# EasyEDA Pro project ProPrj_HPMDuino_DEV_2025-07-16.epro, board PCB1
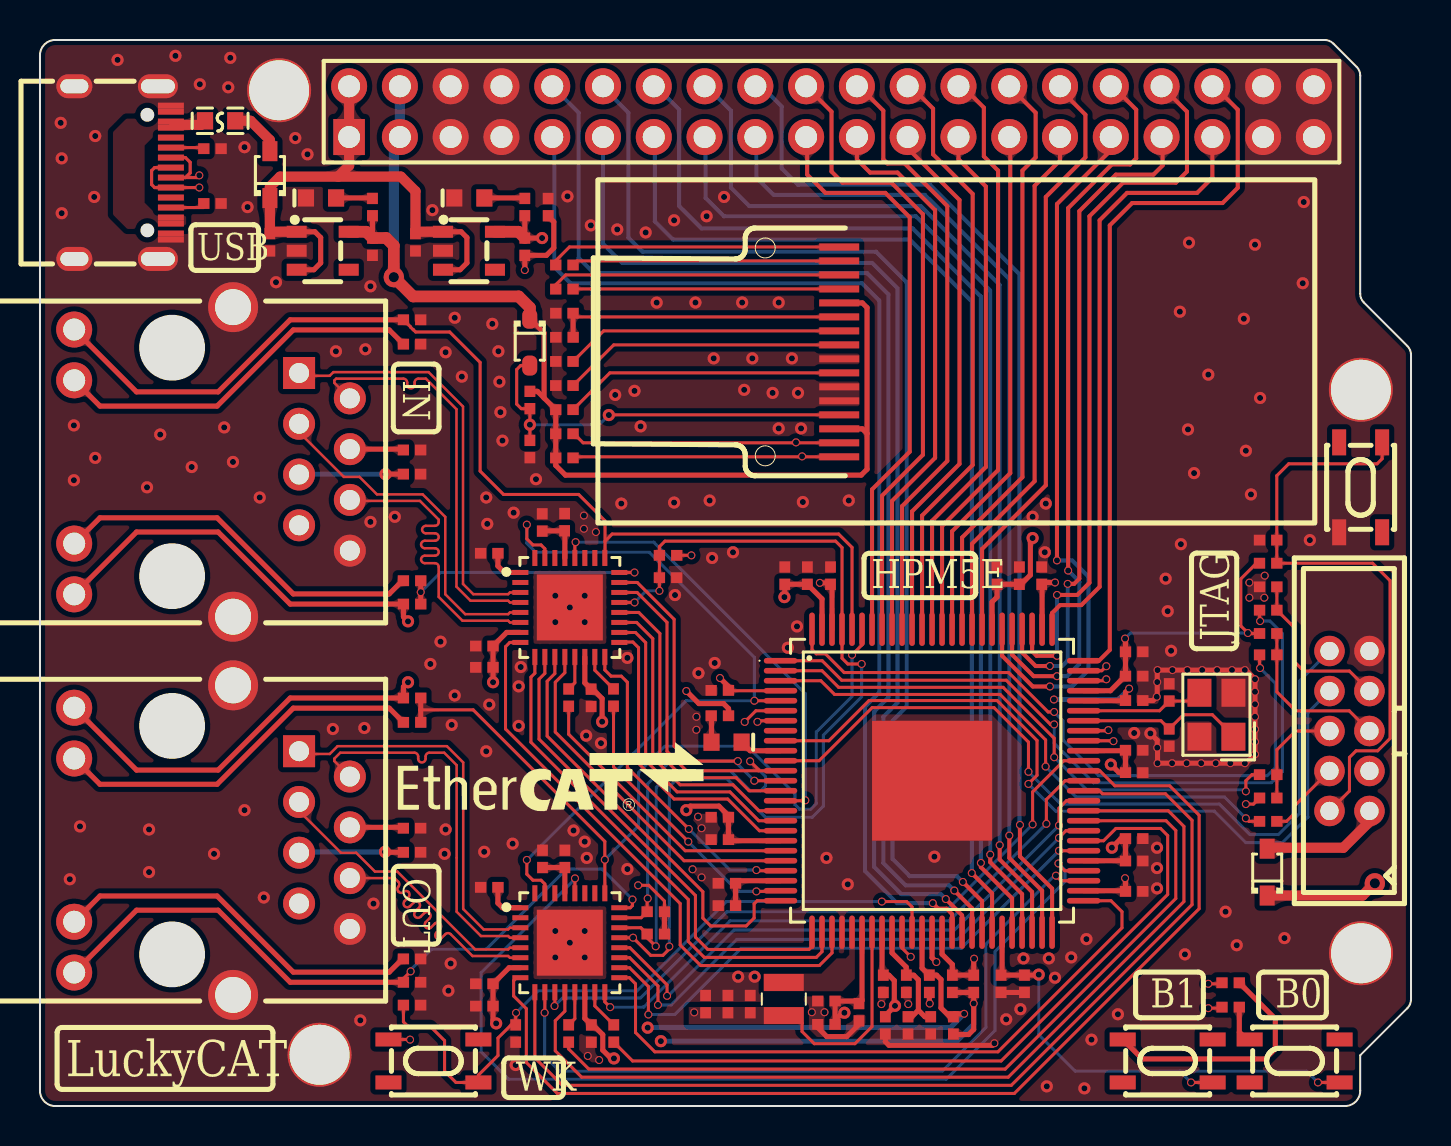
[diagram p6: board, top side]
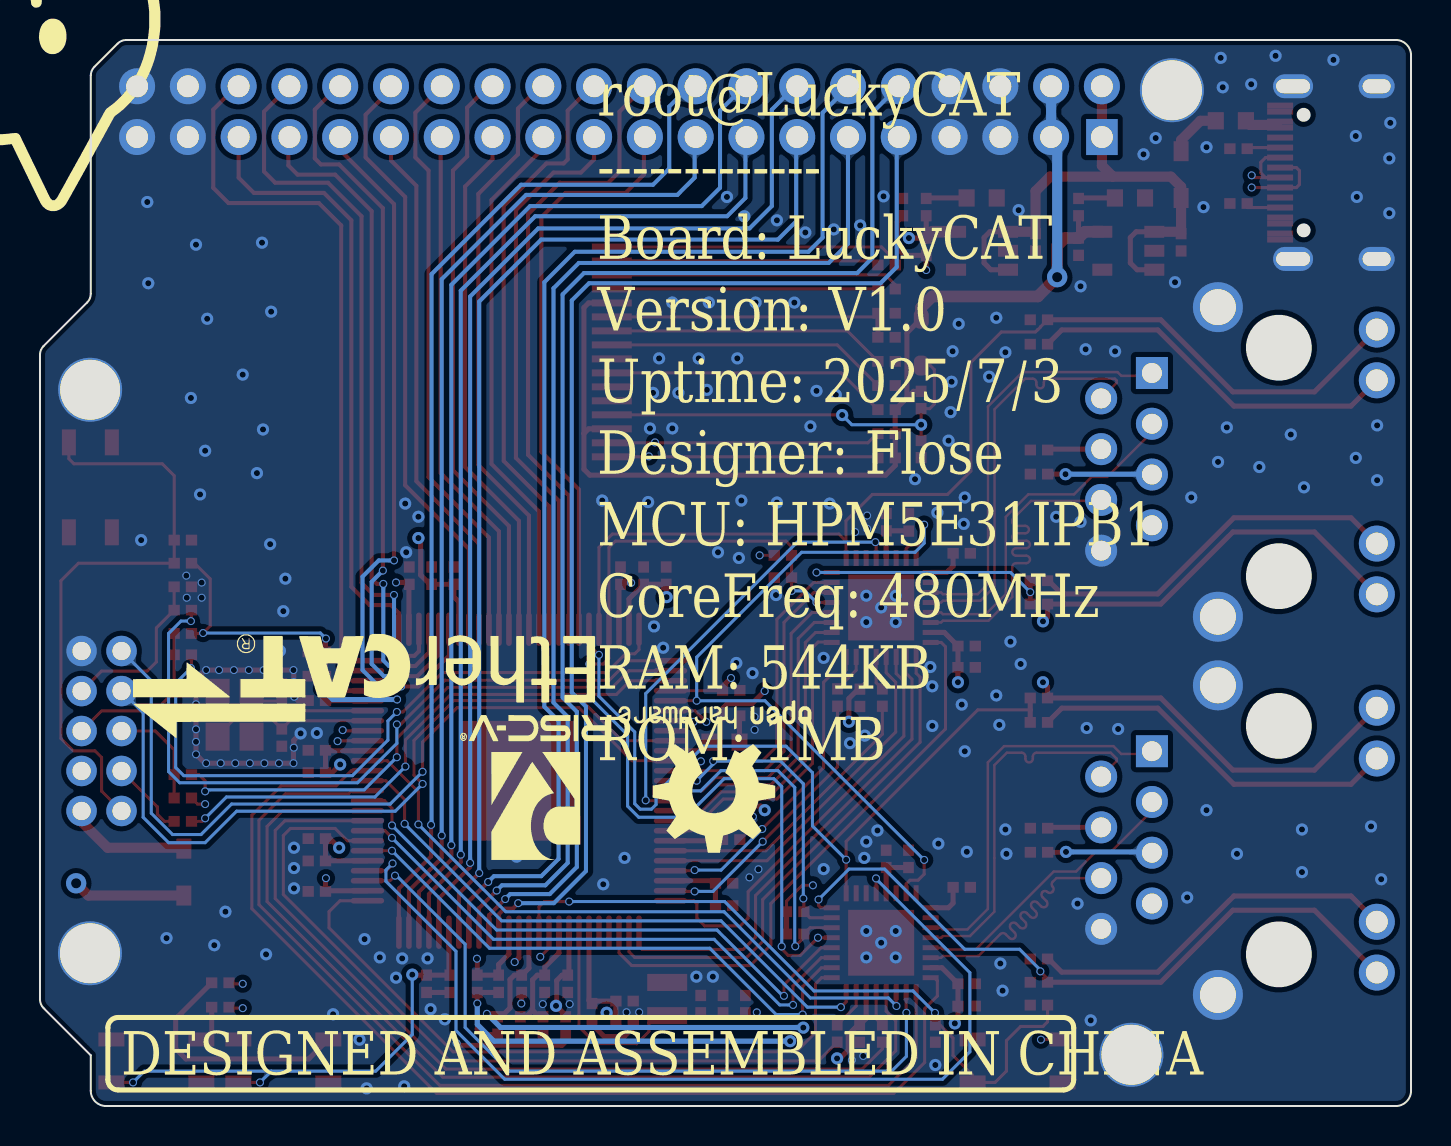
[diagram p7: board, bottom side, seen from below]

Outline 68.58 x 53.34 mm; copper layers: Top Layer, GND, PWR, Bottom Layer. Coordinates in mm from the lower left corner of the outline.
Outline path: 0,52.58 0,0.76 arc(0.22,0.22) 0.76,0 65.28,0 arc(65.82,0.22) 66.04,0.76 66.04,2.54 68.4,4.9 arc(68.53,5.1) 68.58,5.33 68.58,37.59 arc(68.53,37.83) 68.4,38.03 66.22,40.21 arc(66.09,40.41) 66.04,40.64 66.04,51.56 arc(65.99,51.8) 65.86,52 64.7,53.16 arc(64.5,53.29) 64.26,53.34 0.76,53.34 arc(0.22,53.12) 0,52.58
Stack: Top Layer 0.035mm 外层铜厚1oz / Dielectric1 0.2104mm 7628 RC49% 8.6mil / GND 0.0152mm 内层铜厚 / Dielectric2 1.065mm 1.1mm H/HOZ Copper / PWR 0.0152mm 内层铜厚 / Dielectric3 0.2104mm 7628 RC49% 8.6mil / Bottom Layer 0.035mm 外层铜厚1oz

## Design rules (mm)
net ESC0_P0_TD_P: ESC0_P0_TD
net ESC0_P0_TD_N: ESC0_P0_TD
net ESC0_P0_RD_P: ESC0_P0_RD
net ESC0_P0_RD_N: ESC0_P0_RD
net ESC0_P1_TD_P: ESC0_P1_TD
net ESC0_P1_TD_N: ESC0_P1_TD
net ESC0_P1_RD_P: ESC0_P1_RD
net ESC0_P1_RD_N: ESC0_P1_RD
net USB_DM: USB
net USB_DP: USB
template: 自定义配置
spacing copperThickness1oz (default): track to track 0.102, other pairs 0.152 to 0.3
spacing copperThickness2oz: track to track 0.203, other pairs 0.152 to 0.3
spacing copperThicknessInner0.5oz: track to track 0.089, other pairs 0.152 to 0.3
track width copperThickness1oz (default): min 0.102, default 0.254, max 2.54
track width copperThickness2oz: min 0.203, default 0.254, max 2.54
track width copperThickness0.5oz: min 0.089, default 0.254, max 2.54
differential pair differentialPair (default): width min 0.127, default 0.254, max 2.54; gap min 0.152, default 0.152
differential pair ETH/100ohm: width min 0.124, default 0.124, max 0.124; gap min 0.203, default 0.203
differential pair USB/90ohm: width min 0.137, default 0.137, max 0.178; gap min 0.203, default 0.203
via viaSize (default): diameter min 0.3, default 0.61, max 10; hole min 0.201, default 0.305, max 6.299
net GND uses copperRegion1
net VBUS uses copperRegion1
net ESC0_P0_TD_P uses ETH/100ohm
net ESC0_P0_TD_N uses ETH/100ohm
net ESC0_P0_RD_P uses ETH/100ohm
net ESC0_P0_RD_N uses ETH/100ohm
net ESC0_P1_TD_P uses ETH/100ohm
net ESC0_P1_TD_N uses ETH/100ohm
net ESC0_P1_RD_P uses ETH/100ohm
net ESC0_P1_RD_N uses ETH/100ohm
net USB_DM uses USB/90ohm
net USB_DP uses USB/90ohm
diff pair ESC0_P0_TD uses ETH/100ohm
diff pair ESC0_P0_RD uses ETH/100ohm
diff pair ESC0_P1_TD uses ETH/100ohm
diff pair ESC0_P1_RD uses ETH/100ohm
diff pair USB uses USB/90ohm

## Placement (name value [footprint] x y rotation side)
C1  15pF  [c0402-无丝印-全尺寸_2]  56.48 18.43 90 top
C2  1uF  [c0402-无丝印-全尺寸_2]  11.5 43.22 90 top
C3  1uF  [c0402-无丝印-全尺寸_2]  16.63 43 90 top
C4  15pF  [c0402-无丝印-全尺寸_2]  56.48 20.7 270 top
C5  1uF  [c0402-无丝印-全尺寸_2]  18.78 43.22 90 top
C6  1uF  [c0402-无丝印-全尺寸_2]  24.25 43 90 top
C7  22uF  [c0402-无丝印-全尺寸_2]  33.29 5.1 270 top
C8  22uF  [c0402-无丝印-全尺寸_2]  34.41 5.1 270 top
C9  100nF  [c0402-无丝印-全尺寸_2]  35.53 5.1 270 top
C10  100nF  [c0402-无丝印-全尺寸_2]  34.01 20.8 0 top
C11  100nF  [c0402-无丝印-全尺寸_2]  54.73 10.74 180 top
C12  100nF  [c0402-无丝印-全尺寸_2]  54.73 20.29 180 top
C13  100nF  [c0402-无丝印-全尺寸_2]  50.11 26.54 270 top
C14  100nF  [c0402-无丝印-全尺寸_2]  39.54 26.54 270 top
C15  100nF  [c0402-无丝印-全尺寸_2]  61.43 28.32 0 top
C16  100nF  [c0402-无丝印-全尺寸_2]  23.79 3.63 90 top
C17  22uF  [c0402-无丝印-全尺寸_2]  39.34 5.25 0 top
C18  22uF  [c0402-无丝印-全尺寸_2]  39.34 4.08 0 top
C19  100nF  [c0402-无丝印-全尺寸_2]  40.96 4.69 90 top
C20  10uF  [c0402-无丝印-全尺寸_2]  42.29 4.03 90 top
C21  100nF  [c0402-无丝印-全尺寸_2]  42.18 6.12 90 top
C22  10uF  [c0402-无丝印-全尺寸_2]  34.36 10.03 0 top
C23  100nF  [c0402-无丝印-全尺寸_2]  34.36 11.15 0 top
C24  10uF  [c0402-无丝印-全尺寸_2]  44.55 4.03 90 top
C25  10uF  [c0402-无丝印-全尺寸_2]  43.42 4.03 90 top
C26  100nF  [c0402-无丝印-全尺寸_2]  43.34 6.12 90 top
C27  10uF  [c0402-无丝印-全尺寸_2]  45.69 4.03 90 top
C28  100nF  [c0402-无丝印-全尺寸_2]  44.49 6.12 90 top
C29  10uF  [c0402-无丝印-全尺寸_2]  46.7 6.12 90 top
C30  100nF  [c0402-无丝印-全尺寸_2]  45.64 6.12 90 top
C31  10uF  [c0402-无丝印-全尺寸_2]  34.01 14.45 0 top
C32  100nF  [c0402-无丝印-全尺寸_2]  34.01 13.33 0 top
C33  10uF  [c0402-无丝印-全尺寸_2]  54.73 22.73 180 top
C34  100nF  [c0402-无丝印-全尺寸_2]  54.73 21.51 180 top
C35  10uF  [c0402-无丝印-全尺寸_2]  48.99 26.54 270 top
C36  100nF  [c0402-无丝印-全尺寸_2]  47.87 26.54 270 top
C37  10uF  [c0402-无丝印-全尺寸_2]  37.26 26.54 270 top
C38  100nF  [c0402-无丝印-全尺寸_2]  38.39 26.54 270 top
C39  10uF  [c0402-无丝印-全尺寸_2]  54.73 13.38 180 top
C40  100nF  [c0402-无丝印-全尺寸_2]  54.73 12.26 180 top
C41  10uF  [c0402-无丝印-全尺寸_2]  54.73 16.68 180 top
C42  100nF  [c0402-无丝印-全尺寸_2]  54.73 17.8 180 top
C43  10uF  [c0402-无丝印-全尺寸_2]  49.24 6.12 90 top
C44  100nF  [c0402-无丝印-全尺寸_2]  48.08 6.12 90 top
C45  10uF  [c0402-无丝印-全尺寸_2]  22.23 21.95 0 top
C46  100nF  [c0402-无丝印-全尺寸_2]  22.23 23.02 0 top
C47  100nF  [c0402-无丝印-全尺寸_2]  27.57 20.42 90 top
C48  10uF  [c0402-无丝印-全尺寸_2]  25.12 29.2 270 top
C49  100nF  [c0402-无丝印-全尺寸_2]  26.24 29.21 270 top
C50  100nF  [c0402-无丝印-全尺寸_2]  18.61 31.62 0 top
C51  100nF  [c0402-无丝印-全尺寸_2]  18.61 32.82 0 top
C52  100nF  [c0402-无丝印-全尺寸_2]  31.42 26.44 180 top
C53  10uF  [c0402-无丝印-全尺寸_2]  22.23 5 0 top
C54  100nF  [c0402-无丝印-全尺寸_2]  27.58 3.62 90 top
C55  100nF  [c0402-无丝印-全尺寸_2]  22.23 6.12 0 top
C56  1uF  [c0402-无丝印-全尺寸_2]  26.23 42.08 0 top
C57  1uF  [c0402-无丝印-全尺寸_2]  26.23 40.88 0 top
C58  4.7uF  [c0402-无丝印-全尺寸_2]  26.24 38.46 180 top
C59  100nF  [c0402-无丝印-全尺寸_2]  26.23 39.67 0 top
C60  10uF  [c0402-无丝印-全尺寸_2]  25.14 12.37 270 top
C61  100nF  [c0402-无丝印-全尺寸_2]  26.25 12.37 270 top
C62  100nF  [c0402-无丝印-全尺寸_2]  18.61 12.69 0 top
C63  2.2uF  [c0402-无丝印-全尺寸_2]  26.23 37.26 0 top
C64  100nF  [c0402-无丝印-全尺寸_2]  18.61 13.9 0 top
C65  4.7uF  [c0402-无丝印-全尺寸_2]  24.51 32.87 90 top
D1  B16WS  [SOD-323_L1.8-W1.3-LS2.5-RD]  11.5 46.6 90 top
D2  B16WS  [SOD-323_L1.8-W1.3-LS2.5-RD]  61.39 11.7 90 top
D3  1N4148WS  [SOD-323_L1.8-W1.3-LS2.5-RD#2]  24.5 38.22 270 top
F1  BSMD0603-075-6V  [F0603]  9.01 49.3 0 top
H1  -  [HDR-TH_40P-P2.54-V-M-R2-C20-S2.54]  39.59 49.75 0 top
J1  HR911105A  [RJ45-TH_HR911105A]  8.61 32.23 270 top
J2  HR911105A  [RJ45-TH_HR911105A]  8.61 13.3 270 top
L1  4.7uH  [IND-SMD_L2.5-W2.0-VLS252012CX-150M]  37.21 5.35 270 top
L2  NCD0603G1  [LED0603_S]  34.97 18.21 0 top
L3  NCD0603G1  [LED0603_S]  13.43 45.44 180 top
L4  NCD0603G1  [LED0603_S]  20.85 45.44 180 top
OLED1  -  [1.29'OLED-64x128-16P]  45.59 37.71 180 top
P1  2.0-2*5P直简牛  [IDC-TH_10P-P2.00-V-R2-C5-S2.00]  65.5 18.77 90 top
R1  10K  [r0402-无丝印-全尺寸_1]  61.43 27.16 0 top
R2  10K  [r0402-无丝印-全尺寸_1]  34.01 19.53 180 top
R3  0Ω  [r0402-无丝印-全尺寸_1]  25.42 44.98 90 top
R4  10K  [r0402-无丝印-全尺寸_1]  18.61 5.05 180 top
R5  10K  [r0402-无丝印-全尺寸_1]  59.56 4.95 0 top
R6  10K  [r0402-无丝印-全尺寸_1]  16.63 44.98 90 top
R7  10K  [r0402-无丝印-全尺寸_1]  24.25 44.98 90 top
R8  10K  [r0402-无丝印-全尺寸_1]  59.56 6.17 0 top
R9  33Ω  [r0402-无丝印-全尺寸_1]  28.69 20.44 270 top
R10  33Ω  [r0402-无丝印-全尺寸_1]  26.45 20.44 270 top
R11  5.1K  [r0402-无丝印-全尺寸_1]  8.63 47.9 0 top
R12  5.1K  [r0402-无丝印-全尺寸_1]  8.63 45.16 0 top
R13  100Ω  [r0402-无丝印-全尺寸_1]  61.44 24.81 180 top
R14  100Ω  [r0402-无丝印-全尺寸_1]  61.44 22.58 180 top
R15  10K  [r0402-无丝印-全尺寸_1]  61.44 25.98 180 top
R16  100Ω  [r0402-无丝印-全尺寸_1]  61.44 16.58 180 top
R17  10K  [r0402-无丝印-全尺寸_1]  61.44 23.64 180 top
R18  100Ω  [r0402-无丝印-全尺寸_1]  61.44 14.24 180 top
R19  10K  [r0402-无丝印-全尺寸_1]  61.44 15.41 180 top
R20  4.7K  [r0402-无丝印-全尺寸_1]  18.61 39.34 180 top
R21  2.49K  [r0402-无丝印-全尺寸_1]  22.47 27.66 180 top
R22  330Ω  [r0402-无丝印-全尺寸_1]  18.61 38.12 180 top
R23  10K  [r0402-无丝印-全尺寸_1]  31.42 27.55 180 top
R24  4.7K  [r0402-无丝印-全尺寸_1]  18.61 25.12 180 top
R25  330Ω  [r0402-无丝印-全尺寸_1]  18.61 26.28 180 top
R26  33Ω  [r0402-无丝印-全尺寸_1]  28.7 3.63 270 top
R27  390K  [r0402-无丝印-全尺寸_1]  26.23 36.05 0 top
R28  33Ω  [r0402-无丝印-全尺寸_1]  26.45 3.63 270 top
R29  4.7K  [r0402-无丝印-全尺寸_1]  24.51 35.33 90 top
R30  4.7K  [r0402-无丝印-全尺寸_1]  26.23 34.84 0 top
R31  4.7K  [r0402-无丝印-全尺寸_1]  26.23 33.64 0 top
R32  4.7K  [r0402-无丝印-全尺寸_1]  30.8 8.61 0 top
R33  4.7K  [r0402-无丝印-全尺寸_1]  30.8 9.72 0 top
R34  4.7K  [r0402-无丝印-全尺寸_1]  26.23 32.43 0 top
R35  4.7K  [r0402-无丝印-全尺寸_1]  18.61 20.42 180 top
R36  2.49K  [r0402-无丝印-全尺寸_1]  22.47 10.94 180 top
R37  330Ω  [r0402-无丝印-全尺寸_1]  18.61 19.2 180 top
R38  4.7K  [r0402-无丝印-全尺寸_1]  18.61 6.19 180 top
R39  330Ω  [r0402-无丝印-全尺寸_1]  18.61 7.36 180 top
SW1  PTS815SJK250SMTRLFS  [SW-SMD_4P-L4.2-W3.3-P2.15-LS5.1]  19.68 2.26 0 top
SW2  PTS815SJK250SMTRLFS  [SW-SMD_4P-L4.2-W3.3-P2.15-LS5.1]  66.06 30.96 90 top
SW3  PTS815SJK250SMTRLFS  [SW-SMD_4P-L4.2-W3.3-P2.15-LS5.1]  62.76 2.26 0 top
SW4  PTS815SJK250SMTRLFS  [SW-SMD_4P-L4.2-W3.3-P2.15-LS5.1]  56.41 2.26 0 top
U1  XC6210B332MR  [SOT-23-5_L3.0-W1.7-P0.95-LS2.8-BR]  14.14 42.79 180 top
U2  LP5907QMFX-3.3Q1  [SOT-23-5_L3.0-W1.7-P0.95-LS2.8-BR]  21.46 42.79 180 top
U3  JL1111-N032I  [QFN-32_L5.0-W5.0-P0.50-TL-EP3.3]  26.5 24.95 0 top
U4  JL1111-N032I  [QFN-32_L5.0-W5.0-P0.50-TL-EP3.3]  26.5 8.17 0 top
U5  -  [M3无外边]  66.08 7.64 0 top
U5#2  -  [eLQFP-100]  44.62 16.28 0 top
U6  -  [M3无外边]  66.07 35.84 0 top
U7  -  [M3无外边]  11.96 50.82 0 top
U8  -  [M3无外边]  13.98 2.56 0 top
USB1  KH-TYPE-C-16P  [USB-C-SMD_KH-TYPE-C-16P]  4.13 46.71 270 top
X1  24MHz  [CRYSTAL-SMD_4P-L3.2-W2.5-BL]  58.85 19.58 90 top

## Footprints (pads in the part's own frame, mm; a bottom-side part is the same pattern mirrored in y, then rotated)
1.29'OLED-64x128-16P
  rect 2x0.35 smd: 1(5.61,-5.27) 2(5.61,-4.57) 3(5.61,-3.87) 4(5.61,-3.17) 5(5.61,-2.47) 6(5.61,-1.77) 7(5.61,-1.07) 8(5.61,-0.37) 9(5.61,0.33) 10(5.61,1.03) 11(5.61,1.73) 12(5.61,2.43) 13(5.61,3.13) 14(5.61,3.83) 15(5.61,4.53) 16(5.61,5.23)
c0402-无丝印-全尺寸_2
  rect 0.566x0.54 smd: 1(-0.433,0) 2(0.433,0)
CRYSTAL-SMD_4P-L3.2-W2.5-BL
  rect 1.4x1.2 smd: 1(-1.1,-0.85) 2(1.1,-0.85) 3(1.1,0.85) 4(-1.1,0.85)
eLQFP-100
  oval 1.67x0.28 smd: 1(-7.58,6.005) 2(-7.58,5.504) 3(-7.58,5.004) 4(-7.58,4.503) 5(-7.58,4.003) 6(-7.58,3.502) 7(-7.58,3.002) 8(-7.58,2.502) 9(-7.58,2.002) 10(-7.58,1.501) 11(-7.58,1.001) 12(-7.58,0.5) 13(-7.58,0) 14(-7.58,-0.5) 15(-7.58,-1.001) 16(-7.58,-1.501) 17(-7.58,-2.002) 18(-7.58,-2.502) 19(-7.58,-3.002) 20(-7.58,-3.502) 21(-7.58,-4.003) 22(-7.58,-4.503) 23(-7.58,-5.004) 24(-7.58,-5.504) 25(-7.58,-6.005) 51(7.58,-6.005) 52(7.58,-5.504) 53(7.58,-5.004) 54(7.58,-4.503) 55(7.58,-4.003) 56(7.58,-3.502) 57(7.58,-3.002) 58(7.58,-2.502) 59(7.58,-2.002) 60(7.58,-1.501) 61(7.58,-1.001) 62(7.58,-0.5) 63(7.58,0) 64(7.58,0.5) 65(7.58,1.001) 66(7.58,1.501) 67(7.58,2.002) 68(7.58,2.502) 69(7.58,3.002) 70(7.58,3.502) 71(7.58,4.003) 72(7.58,4.503) 73(7.58,5.004) 74(7.58,5.504) 75(7.58,6.005)
  oval 0.28x1.67 smd: 26(-6.005,-7.58) 27(-5.504,-7.58) 28(-5.004,-7.58) 29(-4.503,-7.58) 30(-4.003,-7.58) 31(-3.502,-7.58) 32(-3.002,-7.58) 33(-2.502,-7.58) 34(-2.002,-7.58) 35(-1.501,-7.58) 36(-1.001,-7.58) 37(-0.5,-7.58) 38(0,-7.58) 39(0.5,-7.58) 40(1.001,-7.58) 41(1.501,-7.58) 42(2.002,-7.58) 43(2.502,-7.58) 44(3.002,-7.58) 45(3.502,-7.58) 46(4.003,-7.58) 47(4.503,-7.58) 48(5.004,-7.58) 49(5.504,-7.58) 50(6.005,-7.58) 76(6.005,7.58) 77(5.504,7.58) 78(5.004,7.58) 79(4.503,7.58) 80(4.003,7.58) 81(3.502,7.58) 82(3.002,7.58) 83(2.502,7.58) 84(2.002,7.58) 85(1.501,7.58) 86(1.001,7.58) 87(0.5,7.58) 88(0,7.58) 89(-0.5,7.58) 90(-1.001,7.58) 91(-1.501,7.58) 92(-2.002,7.58) 93(-2.502,7.58) 94(-3.002,7.58) 95(-3.502,7.58) 96(-4.003,7.58) 97(-4.503,7.58) 98(-5.004,7.58) 99(-5.504,7.58) 100(-6.005,7.58)
  rect 6x6 smd: 101(0,0)
F0603
  rect 0.806x0.864 smd: 1(-0.753,0) 2(0.753,0)
HDR-TH_40P-P2.54-V-M-R2-C20-S2.54
  rect 1.575x1.801 hole 1.1: 1(-24.13,-1.27)
  round 1.801 hole 1.1: 2(-24.13,1.27) 3(-21.59,-1.27) 4(-21.59,1.27) 5(-19.05,-1.27) 6(-19.05,1.27) 7(-16.51,-1.27) 8(-16.51,1.27) 9(-13.97,-1.27) 10(-13.97,1.27) 11(-11.43,-1.27) 12(-11.43,1.27) 13(-8.89,-1.27) 14(-8.89,1.27) 15(-6.35,-1.27) 16(-6.35,1.27) 17(-3.81,-1.27) 18(-3.81,1.27) 19(-1.27,-1.27) 20(-1.27,1.27) 21(1.27,-1.27) 22(1.27,1.27) 23(3.81,-1.27) 24(3.81,1.27) 25(6.35,-1.27) 26(6.35,1.27) 27(8.89,-1.27) 28(8.89,1.27) 29(11.43,-1.27) 30(11.43,1.27) 31(13.97,-1.27) 32(13.97,1.27) 33(16.51,-1.27) 34(16.51,1.27) 35(19.05,-1.27) 36(19.05,1.27) 37(21.59,-1.27) 38(21.59,1.27) 39(24.13,-1.27) 40(24.13,1.27)
IDC-TH_10P-P2.00-V-R2-C5-S2.00
  round 1.524 hole 0.914: 1(-4.002,-1) 2(-4.002,1) 3(-2.001,-1) 4(-2.001,1) 5(-0.002,-1) 6(-0.002,1) 7(1.998,-1) 8(1.998,1) 9(4.002,-1) 10(4.002,1)
IND-SMD_L2.5-W2.0-VLS252012CX-150M
  rect 0.85x2 smd: 1(-0.83,0) 2(0.83,0)
LED0603_S
  rect 0.806x0.864 smd: 1(-1.381,-0.001) 2(0.126,-0.001)
M3无外边
  round 3.2 hole 3: 1(0,0)
QFN-32_L5.0-W5.0-P0.50-TL-EP3.3
  rect 0.8x0.25 smd: 1(-2.475,1.75) 2(-2.475,1.25) 3(-2.475,0.75) 4(-2.475,0.25) 5(-2.475,-0.25) 6(-2.475,-0.75) 7(-2.475,-1.25) 8(-2.475,-1.75) 17(2.475,-1.75) 18(2.475,-1.25) 19(2.475,-0.75) 20(2.475,-0.25) 21(2.475,0.25) 22(2.475,0.75) 23(2.475,1.25) 24(2.475,1.75)
  rect 0.25x0.8 smd: 9(-1.75,-2.475) 10(-1.25,-2.475) 11(-0.75,-2.475) 12(-0.25,-2.475) 13(0.25,-2.475) 14(0.75,-2.475) 15(1.25,-2.475) 16(1.75,-2.475) 25(1.75,2.475) 26(1.25,2.475) 27(0.75,2.475) 28(0.25,2.475) 29(-0.25,2.475) 30(-0.75,2.475) 31(-1.25,2.475) 32(-1.75,2.475)
  rect 3.3x3.3 smd: 33(0,0)
r0402-无丝印-全尺寸_1
  rect 0.566x0.54 smd: 1(-0.433,0) 2(0.433,0)
RJ45-TH_HR911105A
  rect 1.6x1.6 hole 1: 1(-4.45,4.355)
  round 1.6 hole 1: 2(-3.18,6.895) 3(-1.91,4.355) 4(-0.64,6.895) 5(0.63,4.355) 6(1.9,6.895) 7(3.17,4.355) 8(4.44,6.895)
  round 1.8 hole 1.1: 9(-6.625,-6.895) 10(-4.085,-6.895) 11(4.085,-6.895) 12(6.625,-6.895)
  round 2.5 hole 1.8: SH1(-7.745,1.055) SH2(7.745,1.055)
SOD-323_L1.8-W1.3-LS2.5-RD
  rect 1x0.75 smd: 1(-1.173,0) 2(1.173,0)
SOD-323_L1.8-W1.3-LS2.5-RD#2
  rrect 1x0.75 smd: 1(-1.173,0) 2(1.173,0)
SOT-23-5_L3.0-W1.7-P0.95-LS2.8-BR
  rect 1x0.6 smd: 1(1.3,-0.95) 2(1.3,0) 3(1.3,0.95) 4(-1.3,0.95) 5(-1.3,-0.95)
SW-SMD_4P-L4.2-W3.3-P2.15-LS5.1
  rect 1.3x0.7 smd: 1(-2.25,1.075) 2(2.25,1.075) 3(-2.25,-1.075) 4(2.25,-1.075)
USB-C-SMD_KH-TYPE-C-16P
  oval 1.2x2 hole 0.7x1.7: 1(-4.32,1.765) 2(4.32,1.765)
  oval 1.2x1.8 hole 0.7x1.4: 3(-4.32,-2.415) 4(4.32,-2.415)
  rect 0.3x1.3 smd: A1(-3.35,2.415) A4(-2.55,2.415) A5(-1.25,2.415) A6(-0.25,2.415) A7(0.25,2.415) A8(1.25,2.415) A9(2.55,2.415) A12(3.35,2.415) B1(3.05,2.415) B4(2.25,2.415) B5(1.75,2.415) B6(0.75,2.415) B7(-0.75,2.415) B8(-1.75,2.415) B9(-2.25,2.415) B12(-3.05,2.415)

## Nets
+5V: C2.2 C5.2 D1.1 D2.1 H1.1 H1.2 U1.1 U1.3 U2.1 U2.3
AGND: C6.1 C27.1 C28.1 C29.1 C30.1 R3.1 U5#2.38
AVCC: C6.2 C27.2 C28.2 C29.2 C30.2 R7.1 U2.5 U5#2.37 U5#2.39
GND: C1.1 C2.1 C3.1 C4.1 C5.1 C7.1 C8.1 C9.1 C10.1 C11.1 C12.1 C13.1 C14.1 C15.1 C16.1 C17.1 C18.1 C19.1 C20.1 C21.1 C22.1 C23.1 C24.1 C25.1 C26.1 C31.1 C32.1 C33.1 C34.1 C35.1 C36.1 C37.1 C38.1 C39.1 C40.1 C41.1 C42.1 C43.1 C44.1 C45.1 C46.1 C47.1 C48.1 C49.1 C50.2 C51.2 C52.1 C53.1 C54.1 C55.1 C58.2 C59.1 C60.1 C61.1 C62.2 C63.1 C64.2 C65.1 H1.5 H1.6 H1.7 H1.8 H1.37 H1.38 H1.39 H1.40 J1.8 J1.SH1 J1.SH2 J2.8 J2.SH1 J2.SH2 L3.2 L4.2 OLED1.9 OLED1.11 OLED1.12 P1.9 R3.2 R4.1 R11.2 R12.2 R15.2 R20.1 R21.2 R22.1 R27.1 R36.2 R38.1 R39.1 SW2.1 U1.2 U2.2 U3.33 U4.33 U5.1 U5#2.29 U5#2.101 U6.1 U7.1 U8.1 USB1.1 USB1.2 USB1.3 USB1.4 USB1.A1 USB1.A12 USB1.B1 USB1.B12 X1.2 X1.4
VBUS: F1.1 USB1.A4 USB1.A9 USB1.B4 USB1.B9
VDD_OTPCAP: C22.2 C23.2 U5#2.23
VDD_PMCCAP: C24.2 C25.2 C26.2 U5#2.34
_JTAG_TCK: P1.7 R13.1 R15.1
_JTAG_TDI: P1.6 R16.1 R19.1
_JTAG_TDO: P1.4 R18.1
_JTAG_TMS: P1.5 R14.1 R17.1
BOOT0: R5.1 U5#2.7
BOOT1: R8.1 U5#2.6
DCDC_IN: C3.2 C17.2 C18.2 C19.2 C20.2 C21.2 C31.2 C32.2 C33.2 C34.2 C35.2 C36.2 C37.2 C38.2 C39.2 C40.2 C41.2 C42.2 C43.2 C44.2 C45.2 C46.2 C47.2 C53.2 C54.2 C55.2 D3.1 H1.3 H1.4 J1.12 J2.9 OLED1.5 OLED1.14 P1.3 R1.1 R2.1 R6.1 R17.2 R19.2 R23.1 R24.2 R29.2 R30.1 R31.1 R32.2 R33.2 R34.1 R35.2 SW1.1 SW3.4 SW4.4 U1.5 U3.7 U3.14 U4.7 U4.14 U5#2.19 U5#2.31 U5#2.33 U5#2.45 U5#2.55 U5#2.66 U5#2.72 U5#2.82 U5#2.99
DCDC_LP: L1.1 U5#2.30
DCDC_SNS: C7.2 C8.2 C9.2 C10.2 C11.2 C12.2 C13.2 C14.2 L1.2 U5#2.4 U5#2.32 U5#2.52 U5#2.71 U5#2.77 U5#2.98
ESC0_MDC: R32.1 U3.22 U4.22 U5#2.12
ESC0_MDIO: R33.1 U3.23 U4.23 U5#2.13
ESC0_P0_LED0: R24.1 R25.1 U3.24
ESC0_P0_LED1: J1.9 R20.2 U3.25 U5#2.96
ESC0_P0_RD_N: J1.6 U3.6
ESC0_P0_RD_P: J1.3 U3.5
ESC0_P0_RXCK: R10.2 U5#2.20
ESC0_P0_RXD_0: U3.9 U5#2.27
ESC0_P0_RXD_1: U3.10 U5#2.26
ESC0_P0_RXD_2: U3.11 U5#2.25
ESC0_P0_RXD_3: U3.12 U5#2.21
ESC0_P0_RXDV: U3.8 U5#2.28
ESC0_P0_RXER: U3.28 U5#2.15
ESC0_P0_TD_N: J1.2 U3.4
ESC0_P0_TD_P: J1.1 U3.3
ESC0_P0_TXCK: R9.2 U5#2.24
ESC0_P0_TXD_0: U3.16 U5#2.22
ESC0_P0_TXD_1: U3.17 U5#2.18
ESC0_P0_TXD_2: U3.18 U5#2.17
ESC0_P0_TXD_3: U3.19 U5#2.16
ESC0_P0_TXEN: U3.20 U5#2.14
ESC0_P1_LED0: J2.12 R38.2 U4.24
ESC0_P1_LED1: R35.1 R37.1 U4.25 U5#2.95
ESC0_P1_RD_N: J2.6 U4.6
ESC0_P1_RD_P: J2.3 U4.5
ESC0_P1_RXCK: R28.2 U5#2.59
ESC0_P1_RXD_0: U4.9 U5#2.62
ESC0_P1_RXD_1: U4.10 U5#2.53
ESC0_P1_RXD_2: U4.11 U5#2.65
ESC0_P1_RXD_3: U4.12 U5#2.60
ESC0_P1_RXDV: U4.8 U5#2.64
ESC0_P1_RXER: U4.28 U5#2.54
ESC0_P1_TD_N: J2.2 U4.4
ESC0_P1_TD_P: J2.1 U4.3
ESC0_P1_TXCK: R26.2 U5#2.57
ESC0_P1_TXD_0: U4.16 U5#2.63
ESC0_P1_TXD_1: U4.17 U5#2.51
ESC0_P1_TXD_2: U4.18 U5#2.56
ESC0_P1_TXD_3: U4.19 U5#2.58
ESC0_P1_TXEN: U4.20 U5#2.61
ESC0_REFCK: U3.31 U4.31 U5#2.5
ESC0_RESET: C52.2 R23.2 U3.21 U4.21 U5#2.97
JTAG_TCK: R13.2 U5#2.1
JTAG_TDI: R16.2 U5#2.2
JTAG_TDO: R18.2 U5#2.3
JTAG_TMS: R14.2 U5#2.100
JTAG_VDD: D2.2 P1.1
OLED_SCL: OLED1.15 R31.2 U5#2.73
OLED_SDA: OLED1.16 R34.2 U5#2.74
PB29: H1.19 U5#2.94
PB30: H1.20 U5#2.93
PB31: H1.21 U5#2.92
PC08: H1.22 U5#2.91
PC09: H1.23 U5#2.90
PC10: H1.24 U5#2.89
PC11: H1.25 U5#2.88
PC12: H1.26 U5#2.87
PC13: H1.27 U5#2.86
PC14: H1.28 U5#2.85
PC15: H1.29 U5#2.84
PC16: H1.30 U5#2.83
PD00: H1.31 U5#2.81
PD01: H1.32 U5#2.80
PD02: H1.33 U5#2.79
PD03: H1.34 U5#2.78
PD04: H1.35 U5#2.76
PD05: H1.36 U5#2.75
PF16: H1.15 U5#2.47
PF18: H1.17 U5#2.49
PF19: H1.11 U5#2.42
PF20: H1.16 U5#2.48
PF21: H1.13 U5#2.44
PF22: H1.14 U5#2.46
PF23: H1.12 U5#2.43
PF24: H1.10 U5#2.41
PF26: H1.18 U5#2.50
PF27: H1.9 U5#2.40
RSTN: C15.2 P1.2 R1.2 SW2.4 U5#2.35
SYS_LED: L2.2 U5#2.10
UART0_RX: P1.8 U5#2.9
UART0_TX: P1.10 U5#2.11
USB_DM: U5#2.67 USB1.A7 USB1.B7
USB_DP: U5#2.68 USB1.A6 USB1.B6
WKUP: C16.2 R4.2 SW1.4 U5#2.36
XTALI: C1.2 U5#2.69 X1.1
XTALO: C4.2 U5#2.70 X1.3
$1N11759: R12.1 USB1.B5
$1N11763: R11.1 USB1.A5
$1N18295: R9.1 U3.15
$1N18373: R10.1 U3.13
$1N18412: R26.1 U4.15
$1N18451: R28.1 U4.13
$1N18860: C48.2 C49.2 U3.29
$1N19227: R21.1 U3.1
$1N19752: C60.2 C61.2 U4.29
$1N19885: R36.1 U4.1
$1N20086: C50.1 J1.5
$1N20091: C51.1 J1.4
$1N20598: C62.1 J2.5
$1N20602: C64.1 J2.4
$1N20817: J2.10 R37.2
$1N20822: J2.11 R39.2
$1N24058: L2.1 R2.2
$1N37197: C56.1 OLED1.1
$1N37201: C56.2 OLED1.2
$1N37238: C57.1 OLED1.3
$1N37242: C57.2 OLED1.4
$1N37324: C58.1 C59.2 OLED1.6
$1N37461: C63.2 OLED1.7
$1N37500: OLED1.8 R27.2
$1N40416: OLED1.10 R30.2
$1N46347: C65.2 D3.2 OLED1.13 R29.1
$1N46902: R5.2 SW3.1
$1N61081: L3.1 R6.2
$1N61162: L4.1 R7.2
$1N72423: R8.2 SW4.1
$1N88332: D1.2 F1.2
$1N115083: J1.11 R25.2
$1N115123: J1.10 R22.2

Pads without a net: J1 7; J2 7; SW1 2 3; SW2 2 3; SW3 2 3; SW4 2 3; U1 4; U2 4; U3 2 26 27 30 32; U4 2 26 27 30 32; U5#2 8; USB1 A8 B8

## Via types
v1: diameter 0.61, hole 0.305, Top Layer to Bottom Layer, 186 vias
v2: diameter 0.4, hole 0.3, Top Layer to Bottom Layer, 148 vias
v3: diameter 1.016, hole 0.508, Top Layer to Bottom Layer, 2 vias

## Routing (per net, layer and track width the routed paths; a pad name or vN(x,y) marks a point on that pad's centre or on a via; arc(x,y) is an arc through that point)
+5V: length 129.4
  Top Layer w0.254: U2.3 21.02,41.84 21.36,42.18 21.36,43.45 21.07,43.74 U2.1 ; U1.1 13.75,43.74 14.04,43.45 14.04,42.18 13.7,41.84 U1.3
  Top Layer w0.508: 14.91,46.5 15.46,47.05 H1.1 H1.2 ; 14.91,46.5 12.01,46.5 11.5,45.99 D1.1 C2.2 11.6,43.74 U1.1 ; 14.91,46.5 18.05,46.5 18.78,45.77 C5.2 18.88,43.74 U2.1 ; v3(66.77,11.15) 66.16,10.53 D2.1
  PWR w0.508: H1.2 15.46,52.19 15.92,52.65 64.28,52.65 65.22,51.71 65.22,38.75 63.52,37.05 63.52,34.67 65.09,33.09 66.82,33.09 67.89,32.02 67.89,12.26 v3(66.77,11.15)
AGND: length 81.6
  Top Layer w0.254: v2(24.25,41.83) C6.1 25.33,42.56 25.7,42.93 25.7,44.24 25.45,44.49 25.42,44.49 ; U5#2.38 44.62,7.42 v2(44.84,7.2) ; C28.1 44.49,5.15 v2(44.5,5.13) ; 45.59,3.6 45.61,3.58 46.45,3.58 46.7,3.83 v2(46.7,5.13) C29.1 C30.1
  PWR w0.254: v2(46.7,5.13) 46.7,5.13 v2(44.5,5.13) 44.5,6.87 v2(44.84,7.2) ; v2(24.25,41.83) 24.25,38.73 25.83,37.15 29.74,37.15 35.27,31.62 35.27,26.89 31.11,22.73 31.11,11.6 32.13,10.59 32.13,7.23 29.64,4.74 29.64,3.6 30.02,3.22 31.03,3.22 v1(31.06,3.25)
  Bottom Layer w0.254: v2(46.7,5.13) 46.7,4.08 45.87,3.25 v1(31.06,3.25)
AVCC: length 83.2
  Top Layer w0.254: R7.1 C6.2 v1(25.11,43.43) ; 44.47,6.55 44.12,6.9 44.12,8.7 ; v2(46.72,7.37) 46.7,7.35 C29.2 C30.2 45.64,7.08 45.12,7.6 U5#2.39 ; v2(46.23,4.61) 45.74,4.61 45.59,4.47 45.51,4.47 45.07,4.91 45.07,6.33 44.85,6.55 C28.2
  Top Layer w0.584: C6.2 23.94,43.74 U2.5
  PWR w0.254: v2(46.23,4.61) 46.24,4.6 46.96,4.6 47.26,4.9 47.26,6.83 46.72,7.37 v2(46.72,7.37) ; v1(30.4,3.92) 30.7,3.92 32.68,5.9 32.68,10.89 31.67,11.91 31.67,22.37 35.88,26.59 35.88,31.92 30.04,37.76 26.13,37.76 25.11,38.78 v1(25.11,43.43)
  Bottom Layer w0.254: v1(30.4,3.92) 30.41,3.93 45.54,3.93 v2(46.23,4.61)
GND: length 27.6
  Top Layer w0.254: C43.1 C44.1 ; C19.1 40.96,4.08 40.36,3.47 39.35,3.47 38.91,3.92 C18.1 ; 55.16,20.29 55.67,20.29 v2(55.86,20.48) 55.89,20.5 v2(55.89,21.21) 55.89,21.8 v2(55.9,21.81) v2(56.64,21.81) v2(57.39,21.81) v2(58.14,21.81) v2(58.88,21.81) v2(59.62,21.81) v2(60.27,21.81) 60.32,21.81 v2(60.78,21.36) v2(60.78,20.73) v2(60.78,20.1) v2(60.78,19.48) v2(60.78,18.85) v2(60.78,18.22) v2(60.78,17.6) 60.33,17.15 v2(60.27,17.15) v2(59.54,17.15) v2(58.81,17.15) v2(58.08,17.15) v2(57.36,17.15) v2(56.63,17.15) v2(55.9,17.15) 55.9,17.92 v2(55.89,17.93) 55.89,18.3 v1(55.54,18.64) ; v2(47.74,3.14) 47.64,3.04 42.47,3.04 42.29,3.22 C20.1
  vias: v1(1.04,49.19) v1(1.09,47.42) v1(1.09,44.67) v1(1.49,11.35) v1(1.7,34.06) v1(1.7,31.31) v1(2,13.99) v1(2.76,48.53) v1(2.71,45.49) v1(2.76,32.43) v1(3.88,52.34) v1(5.35,30.96) v1(5.46,13.84) v1(5.46,11.7) v1(6.01,33.6) v1(6.78,52.55) v1(7.59,31.97) v1(8,51.12) v1(8.71,12.62) v1(9.21,33.95) v1(9.42,50.97) v1(9.52,52.45) v1(9.65,32.23) v1(10.23,47.98) v1(10.23,14.8) v1(10.38,44.98) v1(10.99,30.45) v1(11.2,10.43) v1(11.81,41.22) v1(12.77,48.43) v1(13.38,47.62) v1(14.65,18.86) v1(14.8,37.76) v1(16.02,4.29) v1(16.22,18.92) v1(16.28,37.86) v1(16.53,41.02) v1(16.53,29.23) v1(16.68,10.13) v1(17.75,29.48) v1(19.53,22.12) v1(19.63,44.83) v1(20.04,23.24) v1(20.24,12.62) v1(20.29,37.71) v1(20.29,13.84) v1(20.43,5.77) v1(20.54,7.13) v1(20.59,19.07) v1(20.75,39.44) v1(20.75,20.54) v1(21.1,36.49) v1(22.22,12.72) v1(22.32,30.45) v1(22.37,29.13) v1(22.32,17.75) v1(22.47,20.09) v1(22.63,39.14) v1(22.93,37.76) v1(22.98,36.24) v1(23.03,34.72) v1(23.13,33.29) v1(23.64,13.13) v1(23.69,29.69) v1(23.79,2.05) v1(23.95,21) v1(23.95,19.02) v1(24.05,21.97) v1(24.81,31.36) v1(25.78,25.53) v1(25.78,24.21) v1(25.78,8.76) v1(25.78,7.44) v1(26.39,45.52) v1(26.5,24.95) v1(26.5,8.17) v1(26.69,13.79) v1(27.25,25.53) v1(27.25,24.21) v1(27.25,13.23) v1(27.25,8.76) v1(27.25,7.44) v1(27.32,18.53) v1(27.35,12.42) v1(27.55,44.06) v1(28.06,18.16) v1(28.77,35.58) v1(28.87,43.86) v1(29.08,30.14) v1(29.38,22.42) v1(29.38,11.86) v1(29.74,35.78) v1(30.04,34.01) v1(30.3,43.71) v1(30.85,40.2) v1(31.72,44.32) v1(31.72,30.2) v1(31.76,25.57) v1(32.79,40.2) v1(32.94,21.66) v1(33.34,44.52) v1(33.5,30.3) v1(33.62,27.42) v1(33.7,37.41) v1(33.75,22.17) v1(34.22,45.49) v1(34.67,27.71) v1(34.92,6.47) v1(35.12,40.2) v1(35.22,35.83) v1(35.63,37.41) v1(35.75,6.47) v1(36.65,35.68) v1(36.95,40.2) v1(36.95,33.9) v1(37.41,22.93) v1(37.61,37.41) v1(37.87,24) v1(37.92,35.68) v1(38.07,33.9) v1(38.16,30.22) v1(39.34,12.42) v1(40.46,30.3) v1(40.41,11.09) v1(44.74,12.48) v1(48.33,4.34) v1(49.04,4.85) v1(49.19,7.39) v1(49.65,29.48) v1(50.26,27.71) v1(50.31,30.14) v1(50.36,0.99) v1(50.46,7.39) v1(50.77,6.42) v1(51.58,7.44) v1(52.24,0.88) v1(52.34,8.35) v1(52.6,3.32) v1(53.92,4.59) v1(54.73,18.66) v1(55.87,12.92) v1(55.87,11.91) v1(55.87,10.89) v1(56.31,26.39) v1(56.41,24.76) v1(56.58,22.78) v1(57.02,39.75) v1(57.07,28.11) v1(57.27,7.59) v1(57.42,33.85) v1(57.47,43.2) v1(57.73,31.67) v1(58.44,36.6) v1(59.3,9.72) v1(59.86,8.05) v1(60.22,39.39) v1(60.32,32.79) v1(60.57,30.6) v1(60.78,43.1) v1(61.03,35.43) v1(62.25,8.4) v1(63.16,41.17) v1(63.21,45.23) v1(63.52,28.32) v2(27.21,29.54) v2(27.21,28.88) v2(27.4,2.51) v2(27.81,28.72) v2(27.97,2.3) v2(32.64,11.85) v2(32.84,19.48) v2(32.83,18.82) v2(32.92,14.48) v2(33.09,13.9) v2(33.09,11.44) v2(38.61,4.69) v2(39.24,4.69) v2(42.09,5.1) v2(43.43,5.1) v2(60.49,26.19) v2(60.49,25.43) v2(61.26,26.54) v2(61.24,25.43)
VBUS: length 1.6
  Top Layer w0.508: 6.71,49.09 8.05,49.09 F1.1
VDD_OTPCAP: length 3.4
  Top Layer w0.254: C22.2 C23.2 34.92,11.27 U5#2.23
VDD_PMCCAP: length 6.1
  Top Layer w0.254: U5#2.34 42.62,7.66 43.33,6.95 43.33,6.55 43.71,6.55 43.94,6.31 43.94,4.8 ; 43.94,4.8 44.27,4.47 C24.2 ; 43.94,4.8 43.61,4.47 C25.2
_JTAG_TCK: length 8.5
  Top Layer w0.152: R15.1 R13.1 62.76,23.92 62.76,22.22 63.21,21.76 65.5,21.76 P1.7
_JTAG_TDI: length 5.4
  Top Layer w0.152: P1.6 62.81,18.76 61.87,17.83 R16.1 R19.1
_JTAG_TDO: length 3.9
  Top Layer w0.152: R18.1 62.35,14.24 62.71,14.6 62.71,14.97 P1.4
_JTAG_TMS: length 8.4
  Top Layer w0.152: R17.1 R14.1 61.87,20.72 62.82,19.77 65.49,19.77 P1.5
BOOT0: length 45.1
  Top Layer w0.152: v2(58.44,4.9) 59.07,4.9 R5.1 ; v2(35.89,19.22) 35.94,19.28 U5#2.7
  PWR w0.152: v2(35.89,19.22) 35.43,19.68 34.51,19.68 34.01,19.17 34.01,4.8 36.49,2.31 55.85,2.31 v2(58.44,4.9)
BOOT1: length 44.6
  Top Layer w0.152: R8.1 59.07,6.12 v2(58.44,6.12) ; 37.04,19.78 35.81,19.78 v2(35.25,19.22)
  PWR w0.152: v2(35.25,19.22) 34.54,19.22 34.39,19.07 34.39,4.92 36.7,2.61 55.54,2.61 58.44,5.51 v2(58.44,6.12)
DCDC_IN: length 418.3
  Top Layer w0.152: v2(18.51,3.32) 18.5,3.33 SW1.1 ; SW4.4 v2(57.58,1.18) ; R23.1 v2(32.58,27.55) ; R17.2 60.45,23.64 v2(60.42,23.67) 60.07,24.02 60.07,26.38 60.85,27.16 R1.1 ; v2(29.92,11.04) 30.45,11.04 31.24,10.26 R33.2 ; v2(60.32,15.11) 60.7,15.11 R19.2 ; SW3.4 v2(63.93,1.18)
  Top Layer w0.254: v1(28.12,19.23) 28.12,20.39 27.65,20.86 C47.2 27.25,21.17 U3.14 ; J1.12 4.83,28.72 8.91,28.72 12.52,25.12 R24.2 18.18,24.48 v1(18.41,24.25) ; v1(53.57,17.09) 53.97,16.68 C41.2 C42.2 54.28,17.78 U5#2.66 ; R29.2 24.88,35.76 R30.1 R31.1 R34.1 25.8,32.05 26.28,31.57 41.08,31.57 41.37,31.86 41.37,33.65 ; 39.77,4.3 40.14,4.67 v1(40.24,4.67) ; 39.77,4.3 C18.2 ; 39.77,4.3 C17.2 40.84,5.25 C19.2 41.12,5.28 U5#2.31 ; 41.37,33.65 41.37,39.95 41.14,40.18 OLED1.5 ; 41.37,33.65 41.14,33.88 OLED1.14 ; U4.14 27.25,4.38 C54.2 27.66,4.06 28.15,3.57 28.15,2.8 28.57,2.38 v1(28.71,2.38) ; 42.18,4.47 42.22,4.47 v1(42.77,5.01) 42.73,5.05 42.73,6.28 42.46,6.55 C21.2 42.12,6.61 42.12,8.7 ; U3.7 23.34,23.7 22.66,23.02 22.66,21.95 22.66,21.95 v1(22.66,21.21) ; v1(49.96,6.58) 49.93,6.55 C43.2 C44.2 48.12,6.6 U5#2.45 ; v2(32.33,20.76) 32.96,20.14 34.19,20.14 34.44,19.89 R2.1 ; v1(53.62,12.93) 54.07,13.38 C39.2 C40.2 54.29,12.27 U5#2.55 ; v1(32.33,14.8) 32.53,15.01 33.96,15.01 34.44,14.53 C31.2 C32.2 34.49,13.27 U5#2.19 ; 24.51,39.39 25.22,38.68 25.22,35.43 ; v1(49.65,28.42) 49.54,28.31 49.54,26.57 49.07,26.1 C35.2 C36.2 47.87,25.47 47.62,25.22 U5#2.82 ; R32.2 R33.2 ; R6.1 C3.2 ; v1(18.41,21.2) 18.18,20.97 R35.2 12.52,20.42 8.91,16.81 4.83,16.81 J2.9 ; U4.7 23.46,6.92 22.66,6.12 22.66,4.29 v1(22.82,4.13) ; U5#2.99 39.12,25.37 C38.2 C37.2 37.26,25.48 v1(37.24,25.46) ; U5#2.72 53.55,20.78 54.3,21.53 C33.2 54.3,23.37 v2(54.28,23.39)
  Top Layer w0.584: U1.5 16.32,43.74 C3.2 17.32,43.43 17.7,43.05 v3(17.7,41.47) 18.66,40.51 23.95,40.51 24.51,39.95 24.51,39.39
  PWR w0.152: P1.3 65.5,15.77 60.98,15.77 v2(60.32,15.11) ; 18.51,5.25 v2(18.51,3.32)
  PWR w0.254: v1(32.33,14.8) 32.33,14.8 v2(32.33,20.76) ; 18.41,28.11 v1(18.41,24.25) ; 52.7,19.93 54.28,21.51 v2(54.28,23.39) ; v1(22.66,21.21) 22.66,21.2 ; v1(37.24,25.46) 35.57,25.46 32.33,22.22 32.33,20.76
  PWR w0.381: v1(18.41,24.25) v1(18.41,21.2) ; v1(18.41,21.2) 18.41,11.67 18.06,11.33 ; v1(18.41,21.2) 22.66,21.2 ; v1(53.62,12.93) 54.78,12.93 55.14,12.57 55.14,10.13 54.58,9.57 44.52,9.57 40.24,5.29 v1(40.24,4.67) 41.23,3.68 43.17,3.68 ; 43.17,3.68 42.77,4.07 v1(42.77,5.01) ; 43.17,3.68 43.18,3.69 48.9,3.69 49.96,4.75 v1(49.96,6.58) ; 18.06,11.33 17.8,11.06 17.8,5.96 18.51,5.25 19.63,4.13 v1(22.82,4.13) 22.83,4.12 26.97,4.12 v1(28.71,2.38) ; 18.06,11.33 18.16,11.33 18.65,10.85 28.68,10.85 28.87,11.04 v2(29.92,11.04) ; v2(32.58,27.55) 18.97,27.55 18.41,28.11 18.41,40.76 v3(17.7,41.47) ; 22.67,21.21 24.65,19.23 v1(28.12,19.23)
  PWR w0.508: v1(53.62,12.93) 53.62,17.04 55.55,15.11 v2(60.32,15.11) ; 37.24,27.89 37.77,28.42 v1(49.65,28.42) 51.38,28.42 52.7,27.1 52.7,17.96 v1(53.57,17.09) ; v3(17.7,41.47) 20.65,44.42 26.03,44.42 26.49,43.96 26.49,43.1 37.13,32.46 37.13,25.57 v1(37.24,25.46)
  Bottom Layer w0.152: v2(54.28,23.39) 54.55,23.67 v2(60.42,23.67) ; 57.01,1.75 51.79,1.75 49.96,3.57 v1(49.96,6.58) ; 57.01,1.75 v2(57.58,1.18) ; 57.01,1.75 63.36,1.75 v2(63.93,1.18)
  Bottom Layer w0.508: H1.4 H1.3 17.7,48.18 v3(17.7,41.47)
DCDC_SNS: length 83.4
  Top Layer w0.152: L1.2 37.73,4.52 38.12,4.13 38.12,3.73 38.73,3.12 40.76,3.12 41.62,3.98 U5#2.32 ; U5#2.4 34.46,20.78 C10.2
  Top Layer w0.254: C13.2 50.2,26.2 v2(50.77,26.2) ; U5#2.52 54.27,10.77 C11.2 54.3,11.38 v2(54.28,11.4) ; v2(54.48,20.89) 54.3,20.71 C12.2 54.29,20.28 U5#2.71 ; v2(39.01,26.18) 39.47,26.18 C14.2 39.62,26.03 U5#2.98 ; U5#2.77 50.13,26.1 ; v2(34.01,21.42) 34.44,20.99 C10.2
  PWR w0.254: v2(32.73,4.69) 33.6,5.56 33.6,21 v2(34.01,21.42) 34.25,21.42 v2(39.01,26.18) 49.14,26.18 49.16,26.19 ; v2(54.28,11.4) 53.71,11.4 52.52,12.59 52.52,16.46 49.7,19.28 49.7,20.66 ; 49.16,26.19 49.7,25.65 49.7,20.66 ; 49.16,26.19 49.16,26.2 v2(50.77,26.2) ; 49.7,20.66 50.02,20.34 v2(50.72,20.34)
  Bottom Layer w0.254: v2(54.48,20.89) 53.93,20.34 v2(50.72,20.34)
ESC0_MDC: length 34.3
  Top Layer w0.152: 35.94,16.78 35.94,16.83 v2(35.52,17.25) ; 35.94,16.78 32.34,16.78 31.36,17.75 31.36,24.2 29.87,25.7 U3.22 ; 35.94,16.78 37.04,16.78 ; U4.22 30.06,8.92 R32.1 30.37,8.42 v2(30.8,7.99)
  Bottom Layer w0.152: v2(30.8,7.99) 30.83,8.02 30.83,15.94 31.67,16.78 34.51,16.78 35.53,15.77 36.04,15.77 36.29,16.02 36.29,16.48 v2(35.52,17.25)
ESC0_MDIO: length 28.9
  Top Layer w0.152: U5#2.13 v2(35.73,16.28) ; U3.23 29.88,26.2 31.72,24.35 31.72,18 32.46,17.26 v2(34.91,17.26) ; U4.23 30.07,9.42 R33.1 30.37,10.36 v2(30.4,10.38)
  Bottom Layer w0.152: 35.73,16.28 34.91,17.1 v2(34.91,17.26) 31.53,17.26 30.4,16.12 v2(30.4,10.38)
ESC0_P0_LED0: length 13
  Top Layer w0.152: U3.24 v2(29.74,26.7)
  Top Layer w0.254: R25.1 v2(19.05,25.71) R24.1
  Bottom Layer w0.152: v2(19.05,25.71) 20.03,26.7 v2(29.74,26.7)
ESC0_P0_LED1: length 55.4
  Top Layer w0.152: U5#2.96 40.62,27.95 39.95,28.62 28.62,28.62 28.26,28.26 ; R20.2 18.53,38.99 18.53,38.97 18.67,38.84 18.68,38.84 18.79,38.73 20.49,38.73 22.02,37.21 22.02,31.77 23.18,30.6 26.94,30.6 28.26,29.28 28.26,28.26 ; 28.26,28.26 28.26,27.43 U3.25
  Top Layer w0.254: R20.2 12.52,39.34 8.91,35.73 4.83,35.73 J1.9
ESC0_P0_RD_N: length 17.6
  Top Layer w0.124: J1.6 15.55,30.28 19.01,30.28 19.94,29.34 19.94,29.22 arc(19.89,29.08) 19.76,29.03 19.3,29.03 arc(19.11,28.84) 19.3,28.66 19.76,28.66 arc(19.94,28.47) 19.76,28.28 19.25,28.28 arc(19.06,28.1) 19.25,27.91 19.76,27.91 arc(19.94,27.72) 19.76,27.54 19.25,27.54 arc(19.06,27.35) 19.25,27.16 19.76,27.16 arc(19.89,27.11) 19.94,26.98 19.94,25.47 21.14,24.28 23.42,24.28 23.51,24.2 U3.6
ESC0_P0_RD_P: length 17.6
  Top Layer w0.124: 12.96,34.14 12.96,33.72 15.2,31.48 15.98,31.48 16.85,30.6 19.14,30.6 20.27,29.48 20.27,25.61 21.27,24.61 23.42,24.61 23.51,24.7 U3.5
ESC0_P0_RXCK: length 14.4
  Top Layer w0.152: U5#2.20 32.28,12.77 26.45,18.6 R10.2
ESC0_P0_RXD_0: length 25.7
  Top Layer w0.152: U3.9 24.75,21.66 24.56,21.46 24.56,18.21 32.43,10.33 32.43,8.24 33.23,7.44 38.83,7.44 39.12,7.72 U5#2.27
ESC0_P0_RXD_1: length 24.2
  Top Layer w0.152: U3.10 25.25,21.65 24.96,21.36 24.96,18.36 32.79,10.54 32.79,8.45 33.41,7.83 38.46,7.83 38.62,7.99 U5#2.26
ESC0_P0_RXD_2: length 21.4
  Top Layer w0.152: U5#2.25 35.87,10.27 35.72,10.12 35.72,9.41 35.33,9.01 33.55,9.01 33.16,9.4 33.16,10.72 25.37,18.51 25.37,21.25 25.75,21.64 U3.11
ESC0_P0_RXD_3: length 17.9
  Top Layer w0.152: U3.12 26.25,21.68 25.78,21.2 25.78,18.71 32.22,12.27 U5#2.21
ESC0_P0_RXDV: length 28.7
  Top Layer w0.152: U3.8 23.5,23.2 23.29,22.98 23.29,18.87 32.02,10.13 32.02,8.05 33.05,7.03 38.98,7.03 39.62,7.67 U5#2.28
ESC0_P0_RXER: length 22
  Top Layer w0.152: U3.28 26.75,28.18 v2(26.79,28.21) ; v2(38.28,15.3) 38.26,15.28 U5#2.15
  Bottom Layer w0.152: v2(26.79,28.21) 30.7,28.21 38.28,20.64 v2(38.28,15.3)
ESC0_P0_TD_N: length 21
  Top Layer w0.124: J1.2 14.72,36.18 14.72,36.31 14.81,36.39 18.18,36.39 arc(18.31,36.34) 18.37,36.21 18.37,36.1 arc(18.55,35.91) 18.74,36.1 18.74,36.21 arc(18.79,36.34) 18.93,36.39 19.3,36.39 20.83,34.86 20.83,25.99 21.54,25.28 23.42,25.28 23.51,25.2 U3.4
ESC0_P0_TD_P: length 21
  Top Layer w0.124: U3.3 23.51,25.7 23.42,25.61 21.67,25.61 21.16,26.12 21.16,35 19.44,36.72 14.68,36.72 14.49,36.54 13.1,36.54 12.96,36.68
ESC0_P0_TXCK: length 14
  Top Layer w0.152: v2(35.83,10.74) 37.01,10.74 U5#2.24 ; R9.2 28.69,16.97 v2(32.43,13.23)
  Bottom Layer w0.152: v2(35.83,10.74) 34.92,10.74 v2(32.43,13.23)
ESC0_P0_TXD_0: length 16.1
  Top Layer w0.152: v2(32.45,13.86) 29.38,16.93 29.38,21.2 29.08,21.51 28.57,21.51 28.25,21.82 U3.16 ; U5#2.22 35.87,11.77 v2(35.83,11.81)
  Bottom Layer w0.152: v2(35.83,11.81) 34.51,11.81 v2(32.45,13.86)
ESC0_P0_TXD_1: length 15.4
  Top Layer w0.152: U3.17 29,23.22 29.66,23.22 29.94,22.93 29.94,17.14 31.72,15.36 34.4,15.36 35.99,13.77 U5#2.18
ESC0_P0_TXD_2: length 15.4
  Top Layer w0.152: U5#2.17 35.96,14.27 34.51,15.72 31.87,15.72 30.3,17.29 30.3,23.18 29.79,23.69 28.98,23.69 U3.18
ESC0_P0_TXD_3: length 15.4
  Top Layer w0.152: U3.19 29.84,24.2 30.65,23.39 30.65,17.44 32.02,16.07 34.67,16.07 35.96,14.77 U5#2.16
ESC0_P0_TXEN: length 15.3
  Top Layer w0.152: U3.20 29.95,24.7 31.01,23.64 31.01,17.6 32.18,16.43 34.82,16.43 35.47,15.78 U5#2.14
ESC0_P1_LED0: length 34.8
  Top Layer w0.152: v2(18.54,6.74) 18.18,6.38 R38.2 ; U4.24 29.53,9.92 29.64,10.03 v2(29.64,10.33)
  Top Layer w0.254: R38.2 12.52,6.19 8.91,9.8 4.83,9.8 J2.12
  Bottom Layer w0.152: v2(18.54,6.74) 18.54,6.81 19.58,7.84 22.32,7.84 26.33,11.86 28.11,11.86 v2(29.64,10.33)
ESC0_P1_LED1: length 41.6
  Top Layer w0.152: v2(40.62,22.58) 41.12,23.07 U5#2.95 ; 19.05,19.82 21.67,19.82 28.25,13.24 v2(28.25,12.32) U4.25
  Top Layer w0.254: R35.1 R37.1
  Bottom Layer w0.152: v2(28.25,12.32) 29.94,14.01 29.94,16.68 31.26,18 35.37,18 37.76,15.61 37.76,15.08 37.99,14.85 38.56,14.85 38.83,15.13 38.83,18.71 40.62,20.5 v2(40.62,22.58)
ESC0_P1_RD_N: length 14.4
  Top Layer w0.124: U4.6 23.5,7.42 23.42,7.51 21.64,7.51 20.54,8.6 arc(20.41,8.65) 20.28,8.6 20.09,8.41 arc(19.82,8.41) 19.82,8.67 20.01,8.86 arc(20.01,9.13) 19.75,9.13 19.56,8.94 arc(19.3,8.94) 19.3,9.2 19.49,9.39 arc(19.49,9.66) 19.22,9.66 19.03,9.47 arc(18.77,9.47) 18.77,9.73 18.96,9.92 arc(18.96,10.18) 18.69,10.18 18.5,9.99 arc(18.24,9.99) 18.24,10.26 18.43,10.45 arc(18.49,10.58) 18.43,10.71 arc(18.31,10.76) 18.19,10.71 arc(18.07,10.66) 17.95,10.71 17.93,10.74 arc(17.88,10.86) 17.93,10.98 arc(17.98,11.1) 17.93,11.22 17.74,11.4 J2.6
ESC0_P1_RD_P: length 14.4
  Top Layer w0.124: U4.5 23.5,7.92 23.42,7.83 21.77,7.83 17.87,11.73 16.76,11.73 15.82,12.67 15.06,12.67 12.96,14.77 12.96,15.21
ESC0_P1_RXCK: length 42.9
  Top Layer w0.152: R28.2 26.45,2.86 27.45,1.85 48.28,1.85 56.81,10.38 56.81,13.79 56.33,14.27 U5#2.59
ESC0_P1_RXD_0: length 50.7
  Top Layer w0.152: U4.9 24.75,2.41 26.13,1.04 48.58,1.04 57.63,10.08 57.63,14.29 56.3,15.62 53.15,15.62 53,15.78 U5#2.62
ESC0_P1_RXD_1: length 37.1
  Top Layer w0.152: U4.10 25.25,4.68 v2(25.24,4.67) ; v2(50.82,11.53) 51.07,11.27 U5#2.53
  Bottom Layer w0.152: v2(50.82,11.53) 50.74,11.53 47.31,8.1 47.31,3.93 45.13,1.75 25.98,1.75 25.24,2.48 v2(25.24,4.67)
ESC0_P1_RXD_2: length 33.2
  Top Layer w0.152: v2(49.65,14.09) 49.65,15.72 51.21,17.28 U5#2.65 ; v2(25.74,5) 25.75,5.02 U4.11
  Bottom Layer w0.152: v2(49.65,14.09) 45.28,9.72 34.36,9.72 30.04,5.4 26.14,5.4 v2(25.74,5)
ESC0_P1_RXD_3: length 47.9
  Top Layer w0.152: U4.12 26.25,4.75 25.78,4.27 25.78,2.76 27.1,1.44 48.43,1.44 57.22,10.23 57.22,13.99 56.44,14.77 U5#2.60
ESC0_P1_RXDV: length 54.3
  Top Layer w0.152: U4.8 23.84,6.42 23.69,6.27 23.69,5.51 24.33,4.87 24.33,2.18 25.88,0.63 48.74,0.63 57.98,9.88 57.98,14.55 56.51,16.02 53.77,16.02 53.01,16.78 52.2,16.78
ESC0_P1_RXER: length 50
  Top Layer w0.152: U5#2.54 51.26,11.77 50.94,12.09 v2(50.94,12.14) ; U4.28 26.75,11.38 v2(26.76,11.39)
  Bottom Layer w0.152: v2(26.76,11.39) 26.76,11.37 22.07,6.67 22.07,2.71 23.44,1.34 45.33,1.34 47.77,3.78 47.77,7.74 51.28,11.25 51.28,11.81 v2(50.94,12.14)
ESC0_P1_TD_N: length 19.4
  Top Layer w0.124: U4.4 23.5,8.42 23.42,8.51 22.06,8.51 20.84,9.72 20.84,12.42 20.84,17.06 20.22,17.68 19.48,17.68 arc(19.34,17.62) 19.29,17.49 19.29,17.38 arc(19.1,17.2) 18.92,17.38 18.92,17.49 arc(18.86,17.62) 18.73,17.68 15.02,17.68 14.72,17.38 14.72,17.26 15.5,16.48
ESC0_P1_TD_P: length 19.4
  Top Layer w0.124: 12.96,17.75 13.1,17.61 14.49,17.61 14.88,18 20.35,18 21.17,17.19 21.17,9.86 22.19,8.83 23.42,8.83 23.5,8.92 U4.3
ESC0_P1_TXCK: length 39.1
  Top Layer w0.152: R26.2 29.64,2.26 48.08,2.26 56.41,10.59 56.41,13.53 56.05,13.89 53.82,13.89 53.2,13.27 U5#2.57
ESC0_P1_TXD_0: length 29.9
  Top Layer w0.152: U4.16 28.25,5.21 v2(28.52,4.95) ; U5#2.63 51.28,16.28 50.34,15.34 v2(50.34,14.12)
  Bottom Layer w0.152: v2(50.34,14.12) 45.48,9.27 34.51,9.27 30.2,4.95 v2(28.52,4.95)
ESC0_P1_TXD_1: length 33.6
  Top Layer w0.152: U4.17 29.48,6.42 29.79,6.12 29.79,3.68 30.75,2.71 47.92,2.71 54.12,8.92 54.12,9.72 53.57,10.27 U5#2.51
ESC0_P1_TXD_2: length 28.4
  Top Layer w0.152: v2(30.43,4.58) 30.43,5.98 29.49,6.92 28.98,6.92 ; U5#2.56 v2(50.97,12.77)
  Bottom Layer w0.152: v2(30.43,4.58) 31.76,4.58 35.07,7.89 46.09,7.89 v2(50.97,12.77)
ESC0_P1_TXD_3: length 28.4
  Top Layer w0.152: 28.98,7.42 29.5,7.42 30.91,6.01 v2(30.91,5.06) ; U5#2.58 51.32,13.77 50.97,13.43 v2(50.97,13.42)
  Bottom Layer w0.152: v2(30.91,5.06) 31.58,5.06 34.86,8.34 45.89,8.34 v2(50.97,13.42)
ESC0_P1_TXEN: length 29.1
  Top Layer w0.152: v2(31.37,5.51) 31.37,6.06 29.51,7.92 U4.20 ; U5#2.61 51.34,15.28 50.97,14.9 v2(50.97,14.04)
  Bottom Layer w0.152: v2(31.37,5.51) 31.42,5.51 34.72,8.81 45.74,8.81 v2(50.97,14.04)
ESC0_REFCK: length 37.4
  Top Layer w0.152: U3.31 25.25,27.88 25.06,28.07 24.66,28.07 24.35,28.38 v2(24.35,29.09) ; U5#2.5 v2(35.73,20.28) ; U4.31 25.25,11.11 25.06,11.3 24.66,11.3 24.35,11.6 v2(24.35,12.31)
  Bottom Layer w0.152: v2(24.35,12.31) 32.32,20.28 v2(35.73,20.28) 35.73,22.46 30.48,27.71 24.81,27.71 24.35,28.16 v2(24.35,29.09)
ESC0_RESET: length 48.4
  Top Layer w0.152: v2(41.1,22.12) 40.41,22.12 40.12,22.41 U5#2.97 40.12,27.94 39.8,28.26 31.26,28.26 30.98,27.99 R23.2 C52.2 v2(30.98,25.78) ; U3.21 v2(29.74,25.2) ; v2(31.48,7.98) 31.48,7.86 31.16,7.54 30.55,7.54 v2(29.67,8.42) 28.98,8.42
  Bottom Layer w0.152: v2(29.74,25.2) 30.32,25.78 v2(30.98,25.78) ; v2(41.1,22.12) 41.1,20.48 39.19,18.56 39.19,15.01 38.63,14.45 36.29,14.45 34.36,16.38 31.87,16.38 31.48,15.98 v2(31.48,7.98)
JTAG_TCK: length 37.3
  Top Layer w0.152: v2(61.03,24.26) 61,24.29 R13.2 ; v2(50.73,19.09) 50.54,19.09 48.33,21.31 40.1,21.31 39.13,22.28 U5#2.1
  Bottom Layer w0.152: v2(50.73,19.09) 50.73,18.15 52.7,16.17 61.59,16.17 62.15,16.73 62.15,23.64 61.53,24.26 v2(61.03,24.26)
JTAG_TDI: length 27.7
  Top Layer w0.152: v2(50.73,17.45) 50.73,18.4 48.18,20.95 39.95,20.95 39.12,21.78 U5#2.2 ; R16.2 60.62,16.58 60.32,16.28 v2(60.32,15.75)
  Bottom Layer w0.152: v2(50.73,17.45) 52.36,15.82 60.25,15.82 v2(60.32,15.75)
JTAG_TDO: length 27.7
  Top Layer w0.152: R18.2 60.47,14.24 v2(60.32,14.4) ; U5#2.3 39.06,21.28 39.75,20.59 48.03,20.59 50.3,18.32 v2(50.3,16.99)
  Bottom Layer w0.152: v2(50.3,16.99) 51.83,15.46 59.25,15.46 v2(60.32,14.4)
JTAG_TMS: length 33.5
  Top Layer w0.152: v2(50.73,19.72) 50.43,19.72 48.45,21.69 40.23,21.69 39.29,22.63 38.83,22.63 38.62,22.84 U5#2.100 ; R14.2 61,21.94 v2(61.03,21.91)
  Bottom Layer w0.152: v2(61.03,21.91) 61.79,21.15 61.79,16.94 61.39,16.53 52.95,16.53 51.18,18.31 51.18,19.27 v2(50.73,19.72)
JTAG_VDD: length 6.2
  Top Layer w0.508: P1.1 66.5,14.23 65.2,12.92 61.43,12.92 D2.2
OLED_SCL: length 41.7
  Top Layer w0.152: OLED1.15 27.17,33.18 26.69,33.66 ; U5#2.73 53.27,21.28 v2(53.34,21.35)
  PWR w0.152: v2(37.82,33.21) 52.18,33.21 53.82,31.57 53.82,21.83 v2(53.34,21.35)
OLED_SDA: length 39.6
  Top Layer w0.152: v2(53.34,22.01) 53.11,21.78 U5#2.74 ; R34.2 26.72,32.48 OLED1.16
  PWR w0.152: v2(53.34,22.01) 53.34,31.38 52.22,32.51 v2(38.12,32.51)
PB29: length 29.3
  Top Layer w0.203: U5#2.94 41.62,30.85 43.5,32.74 43.5,44.47 42.29,45.69 39.29,45.69 38.37,46.6 38.37,48.43 H1.19
PB30: length 31.9
  Top Layer w0.203: 42.12,23.86 42.12,30.54 44.17,32.58 44.17,44.62 42.59,46.2 40.15,46.2 39.59,46.76 39.59,49.75 H1.20
PB31: length 27.9
  Top Layer w0.203: U5#2.92 42.62,30.28 44.77,32.43 44.77,44.83 42.89,46.71 41.52,46.71 40.86,47.37 H1.21
PC08: length 30.5
  Top Layer w0.203: U5#2.91 43.12,30.01 45.38,32.28 45.38,45.03 43.25,47.16 42.39,47.16 42.18,47.37 42.18,49.8 40.96,51.02 H1.22
PC09: length 26.7
  Top Layer w0.203: U5#2.90 43.62,29.75 45.99,32.13 45.99,45.33 43.4,47.92 H1.23
PC10: length 29.7
  Top Layer w0.203: 44.12,23.86 44.12,29.54 46.65,32.07 46.65,45.64 44.67,47.62 44.67,49.91 43.56,51.02 H1.24
PC11: length 26.3
  Top Layer w0.203: U5#2.88 44.62,29.28 47.31,31.97 47.31,46.01 45.94,47.38 H1.25
PC12: length 29.3
  Top Layer w0.203: H1.26 46.15,51.02 47.21,49.96 47.21,47.52 47.92,46.81 47.92,31.82 45.12,29.02 U5#2.87
PC13: length 25.9
  Top Layer w0.203: H1.27 48.53,48.43 48.53,31.67 45.62,28.76 U5#2.86
PC14: length 29.2
  Top Layer w0.203: U5#2.85 46.12,28.45 49.14,31.47 49.14,46.81 49.8,47.47 49.8,49.7 H1.28
PC15: length 26.4
  Top Layer w0.203: U5#2.84 46.62,28.13 49.75,31.26 49.75,46.04 51.02,47.31 H1.29
PC16: length 29.8
  Top Layer w0.203: U5#2.83 47.12,27.87 50.31,31.06 50.31,45.49 52.29,47.47 52.29,49.6 51.02,50.87 H1.30
PD00: length 35.5
  Top Layer w0.203: v2(50.87,27.3) 50.87,45.13 53.56,47.82 H1.31 ; U5#2.81 48.12,22.53 49.66,20.99 v2(50.52,20.99)
  Bottom Layer w0.203: v2(50.52,20.99) 51.62,20.99 52.45,21.81 52.45,26.49 51.63,27.3 v2(50.87,27.3)
PD01: length 37
  Top Layer w0.203: U5#2.80 48.62,22.59 49.7,21.51 v2(50.87,21.51) ; H1.32 53.66,51.02 54.83,49.85 54.83,47.42 54.53,47.11 53.61,47.11 51.43,44.93 v2(51.43,26.79)
  Bottom Layer w0.203: v2(51.43,26.79) 51.99,26.23 51.99,22.12 51.38,21.51 v2(50.87,21.51)
PD02: length 33.3
  Top Layer w0.203: U5#2.79 49.13,22.69 49.8,22.02 v2(50.52,22.02) ; H1.33 56.15,48.43 56.15,47.06 55.7,46.6 53.82,46.6 51.99,44.77 51.99,26.39 51.73,26.13 v2(51.41,26.13)
  Bottom Layer w0.203: v2(51.41,26.13) 51.41,22.3 51.12,22.02 v2(50.52,22.02)
PD03: length 36.3
  Top Layer w0.203: U5#2.78 49.63,22.75 49.85,22.52 v2(50.87,22.52) ; H1.34 57.37,49.75 57.37,46.76 56.81,46.2 54.17,46.2 52.5,44.52 52.5,26.18 51.89,25.57 v2(50.87,25.57)
  Bottom Layer w0.203: v2(50.87,22.52) 50.87,25.57 v2(50.87,25.57)
PD04: length 30.6
  Top Layer w0.203: H1.35 58.64,46.45 57.88,45.69 54.38,45.69 53,44.32 53,25.98 52.09,25.06 51.02,25.06 50.63,24.67 U5#2.76
PD05: length 35.6
  Top Layer w0.203: H1.36 58.74,51.02 59.91,49.85 59.91,45.94 59.15,45.18 54.63,45.18 53.51,44.06 53.51,22.82 52.97,22.28 U5#2.75
PF16: length 52
  Top Layer w0.203: U5#2.47 49.13,10.6 47.53,12.2 v2(47.53,12.58)
  Bottom Layer w0.203: v2(47.53,12.58) 47.53,40.8 43.81,44.52 34.21,44.52 33.29,45.44 33.29,48.43 H1.15
PF18: length 50.2
  Top Layer w0.203: v2(48.49,13.53) 48.49,12.41 50.13,10.77 U5#2.49
  Bottom Layer w0.203: H1.17 35.83,48.43 35.83,46.45 36.7,45.59 44.27,45.59 48.49,41.37 v2(48.49,13.53)
PF19: length 56.6
  Top Layer w0.203: v2(45.74,10.78) 46.62,9.89 U5#2.42
  Bottom Layer w0.203: H1.11 28.16,43.15 29.13,42.18 41.62,42.18 42.89,40.91 42.89,20.19 42.18,19.48 42.18,12.16 43.3,11.04 45.48,11.04 v2(45.74,10.78)
PF20: length 54.2
  Top Layer w0.203: U5#2.48 49.63,10.71 48,12.33 v2(48,13.05)
  Bottom Layer w0.203: H1.16 33.34,51.02 34.56,49.8 34.56,45.94 35.48,45.03 44.06,45.03 48,41.09 v2(48,13.05)
PF21: length 53.7
  Top Layer w0.203: U5#2.44 47.62,10.64 v2(46.61,11.66)
  Bottom Layer w0.203: v2(46.61,11.66) 46.61,40.25 43.51,43.35 31.67,43.35 30.75,44.27 30.75,48.43 H1.13
PF22: length 56
  Top Layer w0.203: U5#2.46 48.62,10.39 47.06,11.95 v2(47.06,12.16)
  Bottom Layer w0.203: v2(47.06,12.16) 47.06,40.5 43.66,43.91 33.09,43.91 31.97,45.03 31.97,49.85 30.8,51.02 H1.14
PF23: length 59
  Top Layer w0.203: v2(46.16,11.21) 47.12,10.25 U5#2.43
  Bottom Layer w0.203: v2(46.16,11.21) 45.87,11.5 43.5,11.5 42.64,12.36 42.64,19.27 43.35,19.98 43.35,41.22 41.83,42.74 30.14,42.74 29.43,43.45 29.43,49.7 28.16,50.97 H1.12
PF24: length 60.6
  Top Layer w0.203: v2(45.31,10.36) 46.12,9.54 U5#2.41
  Bottom Layer w0.203: v2(45.31,10.36) 45.06,10.61 43.08,10.61 41.73,11.96 41.73,19.73 42.44,20.44 42.44,40.61 41.37,41.68 27.71,41.68 26.94,42.44 26.94,49.7 H1.10
PF26: length 52.5
  Top Layer w0.203: v2(49.02,14.06) 49.02,12.49 50.63,10.88 U5#2.50
  Bottom Layer w0.203: H1.18 36.09,51.02 37.1,50.01 37.1,46.91 37.92,46.1 44.52,46.1 48.99,41.63 48.99,14.09 v2(49.02,14.06)
PF27: length 58.5
  Top Layer w0.203: v2(44.66,10.15) 44.66,10.14 44.93,9.88 45.35,9.88 45.62,9.6 U5#2.40
  Bottom Layer w0.203: v2(44.66,10.15) 42.87,10.15 41.27,11.75 41.27,19.98 41.98,20.7 41.98,40.3 41.12,41.17 26.54,41.17 25.72,41.98 25.72,48.38 H1.9
RSTN: length 55.6
  Top Layer w0.152: SW2.4 67.14,32.39 66.88,32.13 62.46,32.13 61.87,31.54 C15.2 R1.2 66.66,27.16 67.53,26.28 67.53,18.4 66.91,17.77 65.83,17.77 65.5,17.44 65.5,15.76 P1.2 ; v2(43.56,7.47) 43.12,7.9 U5#2.35
  PWR w0.152: P1.2 61.86,14.76 56.12,9.03 45.12,9.03 v2(43.56,7.47)
SYS_LED: length 2.1
  Top Layer w0.254: U5#2.10 35.52,17.78 35.1,18.21
UART0_RX: length 39.3
  Top Layer w0.152: v2(49.44,16.12) 49.44,16.12 49.87,16.55 49.87,18.29 47.87,20.29 41.47,20.29 39.46,18.28 U5#2.9
  Bottom Layer w0.152: v2(49.44,16.12) 50.81,14.75 58.74,14.75 60.32,13.18 62.15,13.18 63.42,14.45 63.42,19.68 P1.8
UART0_TX: length 39.7
  Top Layer w0.152: U5#2.11 38.97,17.28 41.62,19.93 47.72,19.93 49.45,18.21 v2(49.45,16.72)
  Bottom Layer w0.152: v2(49.45,16.72) 51.06,15.11 59,15.11 60.52,13.58 61.95,13.58 63.01,14.65 63.01,21.28 P1.10
USB_DM: length 79.7
  Top Layer w0.158: v2(53.7,18.26) 53.67,18.28 U5#2.67 ; USB1.B7 7.28,47.46 7.51,47.22 7.51,46.69 7.28,46.46 ; 7.28,46.46 7.86,46.46 v2(7.97,46.57) ; 7.28,46.46 USB1.A7
  PWR w0.136: v2(53.7,18.26) 53.93,18.49 53.93,18.66 55.29,20.01 55.29,44.09 52.94,46.43 8.44,46.43 8.31,46.57 v2(7.97,46.57)
USB_DP: length 79.7
  Top Layer w0.158: U5#2.68 53.41,18.78 v2(53.44,18.81) ; USB1.A6 5.73,46.96 5.58,46.8 5.58,46.11 5.73,45.96 USB1.B6 7.97,45.96 v2(7.97,45.96)
  PWR w0.136: v2(7.97,45.96) 8.31,45.96 8.44,46.09 9.79,46.09 arc(9.94,46.03) 10,45.89 10,45.86 arc(10.2,45.66) 10.41,45.86 10.41,45.89 arc(10.47,46.03) 10.61,46.09 52.8,46.09 54.95,43.95 54.95,20.16 53.84,19.05 53.68,19.05 v2(53.44,18.81)
WKUP: length 34.6
  Top Layer w0.152: v2(23.81,4.66) 23.79,4.64 C16.2 23.57,4.06 22.91,3.4 22.91,2.53 21.93,1.55 SW1.4 20.81,1.18 20.24,1.75 20.24,3.27 19.53,3.98 18.41,3.98 18.18,4.21 R4.2 ; U5#2.36 43.62,9.96 43.35,10.23 v2(42.11,10.23)
  Bottom Layer w0.152: v2(23.81,4.66) 24.91,5.76 29.86,5.76 34.33,10.23 v2(42.11,10.23)
XTALI: length 8.4
  Top Layer w0.152: U5#2.69 56.07,19.28 C1.2 57.2,19.58 58.64,19.58 59.7,18.52 59.7,18.48
XTALO: length 6.2
  Top Layer w0.152: X1.3 57.58,20.26 C4.2 56,19.78 U5#2.70
$1N11759: length 1.6
  Top Layer w0.152: 8.18,44.96 USB1.B5
$1N11763: length 1.6
  Top Layer w0.152: 8.18,47.96 USB1.A5
$1N18295: length 2
  Top Layer w0.152: U3.15 27.75,21.81 R9.1
$1N18373: length 1.7
  Top Layer w0.152: 26.45,20.87 26.75,21.18 U3.13
$1N18412: length 2
  Top Layer w0.152: R26.1 27.75,5.01 U4.15
$1N18451: length 1.8
  Top Layer w0.152: R28.1 26.75,4.37 U4.13
$1N18860: length 2.5
  Top Layer w0.254: C48.2 25.14,28.78 C49.2 26.25,28.77 U3.29
$1N19227: length 1.9
  Top Layer w0.254: R21.1 22.91,27.02 23.23,26.7 U3.1
$1N19752: length 2.4
  Top Layer w0.254: C60.2 C61.2 U4.29
$1N19885: length 2
  Top Layer w0.254: R36.1 22.91,10.15 23.14,9.92 U4.1
$1N20086: length 5
  Top Layer w0.254: C50.1 17.29,31.62 v1(17.28,31.61)
  Bottom Layer w0.254: 13.24,31.54 13.32,31.61 v1(17.28,31.61)
$1N20091: length 2.7
  Top Layer w0.254: J1.4 18.13,32.87 C51.1
$1N20598: length 5.2
  Top Layer w0.254: C62.1 17.28,12.69 v1(17.26,12.72)
  Bottom Layer w0.254: 12.96,12.67 13,12.72 v1(17.26,12.72)
$1N20602: length 2.7
  Top Layer w0.254: J2.4 18.13,13.94 C64.1
$1N20817: length 18.9
  Top Layer w0.254: J2.10 3,16.1 8.86,16.1 12.67,19.91 17.47,19.91 R37.2
$1N20822: length 18.9
  Top Layer w0.254: J2.11 3,10.51 8.86,10.51 12.67,6.7 17.47,6.7 18.18,7.41
$1N24058: length 1.3
  Top Layer w0.254: R2.2 33.59,19.51 33.59,18.21
$1N37197: length 14.7
  Top Layer w0.152: OLED1.1 26.49,42.98 25.8,42.3 C56.1
$1N37201: length 13.4
  Top Layer w0.152: C56.2 26.87,42.29 39.98,42.29 OLED1.2
$1N37238: length 14.6
  Top Layer w0.152: C57.1 25.8,41.09 26.29,41.58 OLED1.3
$1N37242: length 13.3
  Top Layer w0.152: OLED1.4 26.67,40.88 C57.2
$1N37324: length 14.6
  Top Layer w0.152: OLED1.6 26.85,39.48 C59.2
  Top Layer w0.254: C58.1 26.67,38.47 C59.2
$1N37461: length 13.9
  Top Layer w0.152: C63.2 28.19,38.78 OLED1.7
$1N37500: length 14.2
  Top Layer w0.152: R27.2 28.7,38.08 OLED1.8
$1N40416: length 14.1
  Top Layer w0.152: OLED1.10 28.51,36.68 R30.2
$1N46347: length 20.5
  Top Layer w0.152: C65.2 v1(24.51,34.09) R29.1 24.07,34.89 23.85,35.12 23.85,36.85 24.04,37.05 24.51,37.05 ; OLED1.13 28.46,34.58 v1(28.45,34.57)
  Bottom Layer w0.152: v1(24.51,34.09) 27.97,34.09 v1(28.45,34.57)
$1N46902: length 1.9
  Top Layer w0.254: SW3.1 60.36,3.33 59.99,3.7 R5.2
$1N61081: length 1.8
  Top Layer w0.254: R6.2 16.61,45.44 L3.1
